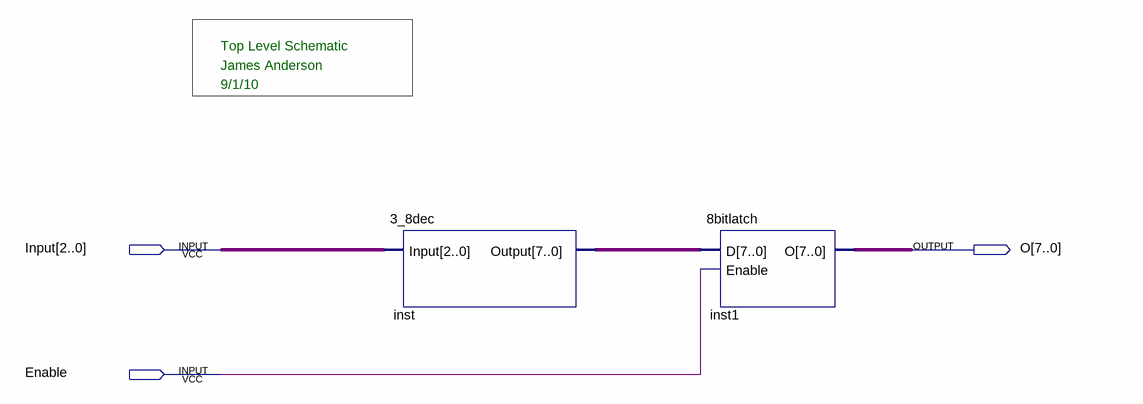
[diagram p0: schematic sheet]
// Quartus schematic TopLevle.bdf as structural Verilog: 2 symbols, 3 pins
module TopLevle (
  input  [2:0] Input,
  input  Enable,
  output [7:0] O
);

  wire [7:0] inst_output;

  \3_8dec  inst (.Input(Input), .Output(inst_output));
  \8bitlatch  inst1 (.D(inst_output), .Enable(Enable), .O(O));

  // Notes on the sheet:
  //   Top Level Schematic
  //   James Anderson
  //   9/1/10
endmodule
